# Altium schematic sheet 电源.SchDoc
size A4
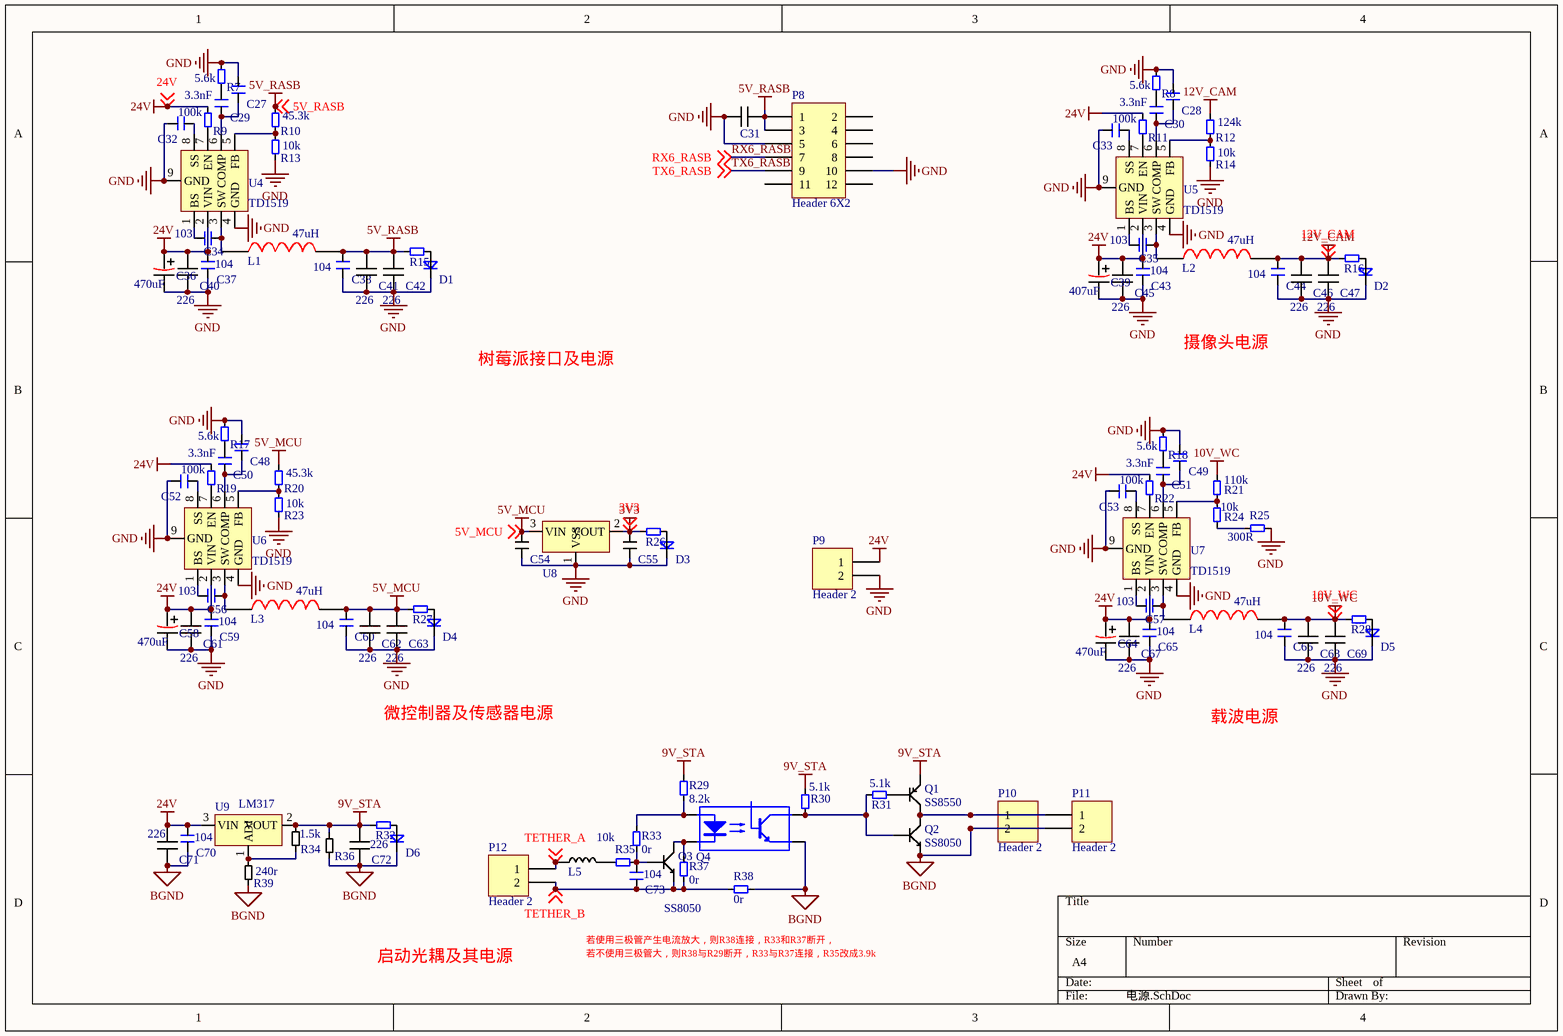
[diagram p0: 电源.SchDoc]

## Parts
C27  0603C  [0603C]  (value not drawn)
C28  0603C  [0603C]  (value not drawn)
C29  Parameter 1: 3.3nF  [0603C]  (hidden comment: 0603C)
C30  Parameter 1: 3.3nF  [0603C]  (hidden comment: 0603C)
C31  1206C  [固态电容5*9]  (value not drawn)
C32  0603C  [0603C]  (value not drawn)
C33  0603C  [0603C]  (value not drawn)
C34  Parameter 1: 103  [0603C]  (hidden comment: 0603C)
C35  Parameter 1: 103  [0603C]  (hidden comment: 0603C)
C36  Parameter 1: 470uF  [CAP-10*10.2]  (hidden comment: 10*10贴片电解电容)
C37  Parameter 1: 104  [0603C]  (hidden comment: 0603C)
C38  Parameter 1: 104  [0603C]  (hidden comment: 0603C)
C39  Parameter 1: 407uF  [CAP-10*10.2]  (hidden comment: 10*10贴片电解电容)
C40  Parameter 1: 226  [1206C]  (hidden comment: 1206C)
C41  Parameter 1: 226  [1206C]  (hidden comment: 1206C)
C42  Parameter 1: 226  [1206C]  (hidden comment: 1206C)
C43  Parameter 1: 104  [0603C]  (hidden comment: 0603C)
C44  Parameter 1: 104  [0603C]  (hidden comment: 0603C)
C45  Parameter 1: 226  [1206C]  (hidden comment: 1206C)
C46  Parameter 1: 226  [1206C]  (hidden comment: 1206C)
C47  Parameter 1: 226  [1206C]  (hidden comment: 1206C)
C48  0603C  [0603C]  (value not drawn)
C49  0603C  [0603C]  (value not drawn)
C50  Parameter 1: 3.3nF  [0603C]  (hidden comment: 0603C)
C51  Parameter 1: 3.3nF  [0603C]  (hidden comment: 0603C)
C52  0603C  [0603C]  (value not drawn)
C53  0603C  [0603C]  (value not drawn)
C54  0805C  [0805C]  (value not drawn)
C55  0805C  [0805C]  (value not drawn)
C56  Parameter 1: 103  [0603C]  (hidden comment: 0603C)
C57  Parameter 1: 103  [0603C]  (hidden comment: 0603C)
C58  Parameter 1: 470uF  [CAP-10*10.2]  (hidden comment: 10*10贴片电解电容)
C59  Parameter 1: 104  [0603C]  (hidden comment: 0603C)
C60  Parameter 1: 104  [0603C]  (hidden comment: 0603C)
C61  Parameter 1: 226  [1206C]  (hidden comment: 1206C)
C62  Parameter 1: 226  [1206C]  (hidden comment: 1206C)
C63  Parameter 1: 226  [1206C]  (hidden comment: 1206C)
C64  Parameter 1: 470uF  [CAP-10*10.2]  (hidden comment: 10*10贴片电解电容)
C65  Parameter 1: 104  [0603C]  (hidden comment: 0603C)
C66  Parameter 1: 104  [0603C]  (hidden comment: 0603C)
C67  Parameter 1: 226  [1206C]  (hidden comment: 1206C)
C68  Parameter 1: 226  [1206C]  (hidden comment: 1206C)
C69  Parameter 1: 226  [1206C]  (hidden comment: 1206C)
C70  Parameter 1: 104  [0603C]  (hidden comment: 0603C)
C71  Parameter 1: 226  [1206C]  (hidden comment: 1206C)
C72  Parameter 1: 226  [1206C]  (hidden comment: 1206C)
C73  Parameter 1: 104  [0603C]  (hidden comment: 0603C)
D1  0603D  [0603D]  (value not drawn)
D2  0603D  [0603D]  (value not drawn)
D3  0603D  [0603D]  (value not drawn)
D4  0603D  [0603D]  (value not drawn)
D5  0603D  [0603D]  (value not drawn)
D6  0603D  [0603D]  (value not drawn)
L1  Parameter 1: 47uH  [1265L]  (hidden comment: 1265L)
L2  Parameter 1: 47uH  [1265L]  (hidden comment: 1265L)
L3  Parameter 1: 47uH  [1265L]  (hidden comment: 1265L)
L4  Parameter 1: 47uH  [1265L]  (hidden comment: 1265L)
L5  0805L  [0805L]  (value not drawn)
P8  Header 6X2  [HDR2X6]
P9  Header 2  [DB129]
P10  Header 2  [HDR1X2]
P11  Header 2  [HDR1X2]
P12  Header 2  [DB129]
Q1  SS8550  [SOT23-3]
Q2  SS8050  [SOT23-3]
Q3  SS8050  [SOT23-3]
Q4  光耦  [DIP4]  (value not drawn)
R7  Parameter 1: 5.6k  [0603R]  (hidden comment: 0603R)
R8  Parameter 1: 5.6k  [0603R]  (hidden comment: 0603R)
R9  Parameter 1: 100k  [0603R]  (hidden comment: 0603R)
R10  Parameter 1: 45.3k  [0603R]  (hidden comment: 0603R)
R11  Parameter 1: 100k  [0603R]  (hidden comment: 0603R)
R12  Parameter 1: 124k  [0603R]  (hidden comment: 0603R)
R13  Parameter 1: 10k  [0603R]  (hidden comment: 0603R)
R14  Parameter 1: 10k  [0603R]  (hidden comment: 0603R)
R15  0603R  [0603R]  (value not drawn)
R16  0603R  [0603R]  (value not drawn)
R17  Parameter 1: 5.6k  [0603R]  (hidden comment: 0603R)
R18  Parameter 1: 5.6k  [0603R]  (hidden comment: 0603R)
R19  Parameter 1: 100k  [0603R]  (hidden comment: 0603R)
R20  Parameter 1: 45.3k  [0603R]  (hidden comment: 0603R)
R21  Parameter 1: 110k  [0603R]  (hidden comment: 0603R)
R22  Parameter 1: 100k  [0603R]  (hidden comment: 0603R)
R23  Parameter 1: 10k  [0603R]  (hidden comment: 0603R)
R24  Parameter 1: 10k  [0603R]  (hidden comment: 0603R)
R25  Parameter 1: 300R  [0603R]  (hidden comment: 0603R)
R26  0603R  [0603R]  (value not drawn)
R27  0603R  [0603R]  (value not drawn)
R28  0603R  [0603R]  (value not drawn)
R29  Parameter 1: 8.2k  [0603R]  (hidden comment: 0603R)
R30  Parameter 1: 5.1k  [0603R]  (hidden comment: 0603R)
R31  Parameter 1: 5.1k  [0603R]  (hidden comment: 0603R)
R32  0603R  [0603R]  (value not drawn)
R33  Parameter 1: 0r  [0603R]  (hidden comment: 0603R)
R34  Parameter 1: 1.5k  [0805R]  (hidden comment: 0805R)
R35  Parameter 1: 10k  [0603R]  (hidden comment: 0603R)
R36  0805R  [0805R]  (value not drawn)
R37  Parameter 1: 0r  [0603R]  (hidden comment: 0603R)
R38  Parameter 1: 0r  [0603R]  (hidden comment: 0603R)
R39  Parameter 1: 240r  [0805R]  (hidden comment: 0805R)
U4  TD1519  [SOP8-PAD]
U5  TD1519  [SOP8-PAD]
U6  TD1519  [SOP8-PAD]
U7  TD1519  [SOP8-PAD]
U8  662k  [SOT23-3]  (value not drawn)
U9  LM317  [TO252-3]

## Nets
3V3: C55.2 R26.1 U8.2(VOUT) ; off-sheet 3V3
5V_MCU: C54.2 C60.2 C62.1 C63.1 L3.2 R20.2 R27.1 U8.3(VIN) ; off-sheet 5V_MCU
5V_RASB: C31.2 C38.2 C41.1 C42.1 L1.2 P8.1 P8.3 R10.2 R15.1 ; off-sheet 5V_RASB
9V_STA: C72.1 Q1.2(E) R29.1 R30.1 R32.1 R34.2 R36.2 U9.2(VOUT)
10V_WC: C66.2 C68.1 C69.1 L4.2 R21.2 R28.1 ; off-sheet 10V_WC
12V_CAM: C44.2 C46.1 C47.1 L2.2 R12.2 R16.1 ; off-sheet 12V_CAM
24V: C36.1 C37.2 C39.1 C40.1 C43.2 C45.1 C58.1 C59.2 C61.1 C64.1 C65.2 C67.1 C70.2 C71.1 P9.1 R9.2 R11.2 R19.2 R22.2 U4.2(VIN) U5.2(VIN) U6.2(VIN) U7.2(VIN) U9.3(VIN) ; off-sheet 24V
BGND: C70.1 C71.2 C72.2 D6.2 P10.2 P11.2 Q2.2(E) Q4.3(Emitter) R36.1 R38.2 R39.1
GND: C27.1 C28.1 C31.1 C32.2 C33.2 C36.2 C37.1 C38.1 C39.2 C40.2 C41.2 C42.2 C43.1 C44.1 C45.2 C46.2 C47.2 C48.1 C49.1 C52.2 C53.2 C54.1 C55.1 C58.2 C59.1 C60.1 C61.2 C62.2 C63.2 C64.2 C65.1 C66.1 C67.2 C68.2 C69.2 D1.2 D2.2 D3.2 D4.2 D5.2 P8.5 P8.10 P9.2 R7.2 R8.2 R13.1 R14.1 R17.2 R18.2 R23.1 R25.1 U4.4(GND) U4.9(GND) U5.4(GND) U5.9(GND) U6.4(GND) U6.9(GND) U7.4(GND) U7.9(GND) U8.1(VSS)
RX6_RASB: P8.7 ; off-sheet RX6_RASB
TETHER_A: L5.1 P12.1 ; off-sheet TETHER_A
TETHER_B: C73.1 P12.2 Q3.2(E) R37.1 R38.1 ; off-sheet TETHER_B
TX6_RASB: P8.9 ; off-sheet TX6_RASB
NetC27_2: C27.2 C29.2 U4.6(COMP)
NetC28_2: C28.2 C30.2 U5.6(COMP)
NetC29_1: C29.1 R7.1
NetC30_1: C30.1 R8.1
NetC32_1: C32.1 U4.8(SS)
NetC33_1: C33.1 U5.8(SS)
NetC34_1: C34.1 L1.1 U4.3(SW)
NetC34_2: C34.2 U4.1(BS)
NetC35_1: C35.1 L2.1 U5.3(SW)
NetC35_2: C35.2 U5.1(BS)
NetC48_2: C48.2 C50.2 U6.6(COMP)
NetC49_2: C49.2 C51.2 U7.6(COMP)
NetC50_1: C50.1 R17.1
NetC51_1: C51.1 R18.1
NetC52_1: C52.1 U6.8(SS)
NetC53_1: C53.1 U7.8(SS)
NetC56_1: C56.1 L3.1 U6.3(SW)
NetC56_2: C56.2 U6.1(BS)
NetC57_1: C57.1 L4.1 U7.3(SW)
NetC57_2: C57.2 U7.1(BS)
NetC73_2: C73.2 Q3.1(B) R33.1 R35.1
NetD1_1: D1.1 R15.2
NetD2_1: D2.1 R16.2
NetD3_1: D3.1 R26.2
NetD4_1: D4.1 R27.2
NetD5_1: D5.1 R28.2
NetD6_1: D6.1 R32.2
NetL5_2: L5.2 R35.2
NetP10_1: P10.1 P11.1 Q1.3(C) Q2.3(C)
NetQ1_1: Q1.1(B) R31.2
NetQ2_1: Q2.1(B) Q4.4(Collector) R30.2 R31.1
NetQ3_3: Q3.3(C) Q4.2(LED_Cathode) R37.2
NetQ4_1: Q4.1(LED_Anode) R29.2 R33.2
NetR9_1: R9.1 U4.7(EN)
NetR10_1: R10.1 R13.2 U4.5(FB)
NetR11_1: R11.1 U5.7(EN)
NetR12_1: R12.1 R14.2 U5.5(FB)
NetR19_1: R19.1 U6.7(EN)
NetR20_1: R20.1 R23.2 U6.5(FB)
NetR21_1: R21.1 R24.2 U7.5(FB)
NetR22_1: R22.1 U7.7(EN)
NetR24_1: R24.1 R25.2
NetR34_1: R34.1 R39.2 U9.1(ADJ)

Not connected (* = marked no-connect by the designer): P8 2 4 6 8 11 12

## Notes on the sheet
- 树莓派接口及电源
- 摄像头电源
- 微控制器及传感器电源
- 载波电源
- 启动光耦及其电源
- 若使用三极管产生电流放大，则R38连接，R33和R37断开，
- 若不使用三极管大，则R38与R29断开，R33与R37连接，R35改成3.9k

## Library data of the parts
P8 = Header 6X2: Header, 6-Pin, Dual row; LatestRevisionDate: 17-Jul-2002; LatestRevisionNote: Re-released for DXP Platform.; Publisher: Altium Limited
P9-P12 = Header 2: Header, 2-Pin; LatestRevisionDate: 17-Jul-2002; LatestRevisionNote: Re-released for DXP Platform.; Publisher: Altium Limited
Q4 = LTV-8141S